# Altium schematic sheet driver_V1.3.SchDoc
size A4
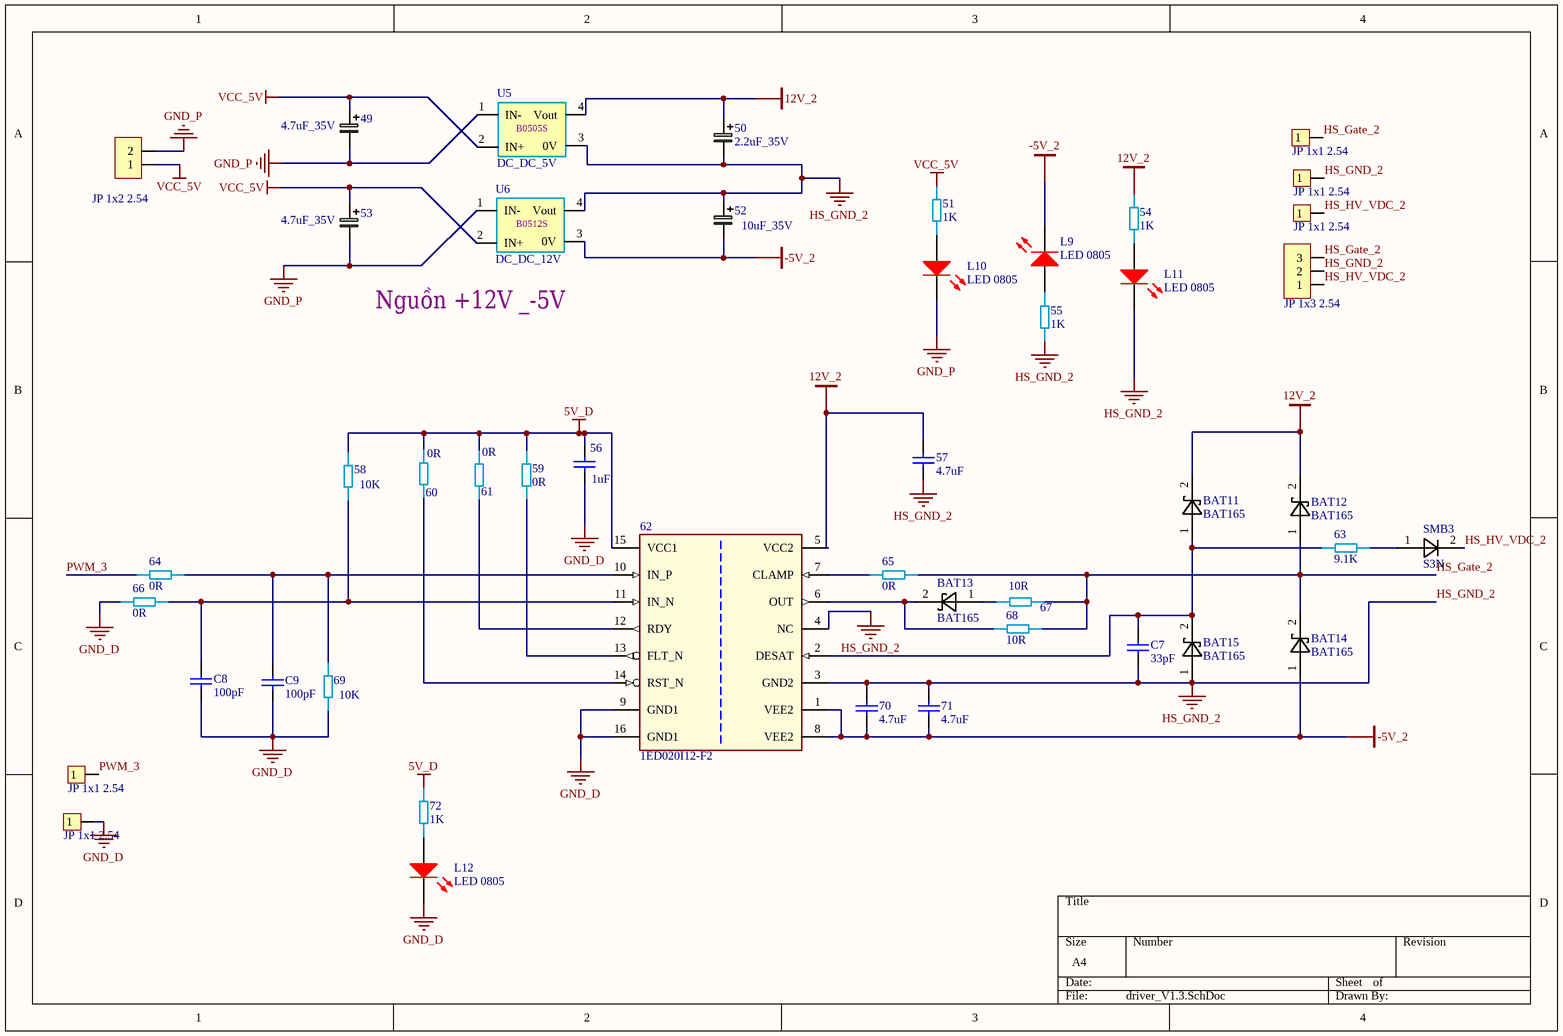
[diagram p0: driver_V1.3.SchDoc]

## Parts
49  4.7uF_35V  [tu_4x5.4mm]
50  2.2uF_35V  [tu_4x5.4mm]
51  1K  [RES1206]
52  10uF_35V  [tu_4x5.4mm]
53  4.7uF_35V  [tu_4x5.4mm]
54  1K  [RES1206]
55  1K  [RES1206]
56  1uF  [Tu 0805_N]
57  4.7uF  [tu 1206_N]
58  10K  [RES1206]
59  0R  [RES1206]
60  0R  [RES1206]
61  0R  [RES1206]
62  1ED020I12-F2  [SOIC127P1028X264-16N-1]
63  9.1K  [RES_2512]
64  0R  [RES1206]
65  0R  [RES_2512]
66  0R  [RES1206]
67  10R  [RES_2512]
68  10R  [RES_2512]
69  10K  [RES1206]
70  4.7uF  [tu 1206_N]
71  4.7uF  [tu 1206_N]
72  1K  [RES1206]
BAT11  BAT165  [SMB]
BAT12  BAT165  [SMB]
BAT13  BAT165  [SMB]
BAT14  BAT165  [SMB]
BAT15  BAT165  [SMB]
C7  33pF  [Tu 0805_N]
C8  100pF  [Tu 0805_N]
C9  100pF  [Tu 0805_N]
JP16  JP 1x1 2.54  [test_point]
JP17  JP 1x2 2.54  [JP 1x2 DT_n]
JP18  JP 1x1 2.54  [test_point]
JP19  JP 1x1 2.54  [test_point]
JP20  JP 1x3 2.54  [XH2.54M-3]
JP21  JP 1x1 2.54  [test_point]
JP22  JP 1x1 2.54  [test_point]
L9  LED 0805  [LED-0805-Red]
L10  LED 0805  [LED-0805-Red]
L11  LED 0805  [LED-0805-Red]
L12  LED 0805  [LED-0805-Red]
SMB3  S3N  [SMB]
U5  DC_DC_5V  [B0505S/D-1W]
U6  DC_DC_12V  [B0512S/D-1W]

## Nets
5V_D: 56.2 58.2 59.1 60.2 61.1 62.15(VCC1) 72.1
12V_2: 50.1 54.1 57.2 62.5(VCC2) BAT11.2 BAT12.2 U5.4(Vout)
-5V_2: 52.2 62.1(VEE2) 62.8(VEE2) 70.1 71.1 BAT14.1 L9.2(K) U6.3(0V)
GND_D: 56.1 62.9(GND1) 62.16(GND1) 66.2 69.1 C8.1 C9.1 JP22.1 L12.2(K)
GND_P: 49.2 53.2 JP17.2 L10.2(K) U5.1(IN-) U6.1(IN-)
HS_GND_2: 50.2 52.1 55.2 57.1 62.3(GND2) 62.4(NC) 70.2 71.2 BAT15.1 C7.1 JP18.1 JP20.2 L11.2(K) U5.3(0V) U6.4(Vout)
VCC_5V: 49.1 51.1 53.1 JP17.1 U5.2(IN+) U6.2(IN+)
HS_Gate_2: 65.2 67.2 68.2 BAT12.1 BAT14.2 JP16.1 JP20.3
HS_HV_VDC_2: JP19.1 JP20.1 SMB3.2
PWM_3: 64.2 JP21.1
Net51_2: 51.2 L10.1(A)
Net54_2: 54.2 L11.1(A)
Net55_1: 55.1 L9.1(A)
Net58_1: 58.1 62.11(IN_N) 66.1 C8.2
Net59_2: 59.2 62.13(FLT_N)
Net60_1: 60.1 62.14(RST_N)
Net61_2: 61.2 62.12(RDY)
Net62_2: 62.2(DESAT) 63.1 BAT11.1 BAT15.2 C7.2
Net62_6: 62.6(OUT) 68.1 BAT13.2
Net62_7: 62.7(CLAMP) 65.1
Net62_10: 62.10(IN_P) 64.1 69.2 C9.2
Net63_2: 63.2 SMB3.1
Net67_1: 67.1 BAT13.1
Net72_2: 72.2 L12.1(A)

## Notes on the sheet
- Nguồn +12V _-5V
- (in symbol DC_DC_5v) B0505S
- (in symbol DC_DC_12v) B0512S

## Library data of the parts
49 50 52 53 = capacitor_electric
51 54 55 58-61 63-69 72 = 311-0.0GRTR-ND
56 C7-C9 = cap_0805
57 70 71 = cap_1210
62 = 1ED020I12-F2: Single IGBT Driver IC; Manufacturer: Infineon Technologies; Manufacturer Order Number: 1ED020I12-F2; PackageReference: PG-DSO-16-15
JP16 JP18 JP19 JP21 JP22 = JP 1x1 2.54 Duc Thang: Cắm; Ten_Linh_Kien: Jump Đơn Đực 2.54MM 1x40P Thẳng 11MM; Don_Vi: Con; Ma_Hang: MH000903; Ghi_Chu: *; Kieu_Chan: *; Chung_Loai: Cắm
JP17 = JP 1x2 2.54 Duc Thang: Cắm; Ten_Linh_Kien: Jump Đơn Đực 2.54MM 1x40P Thẳng 11MM; Don_Vi: Con; Ma_Hang: MH000903; Ghi_Chu: *; Kieu_Chan: *; Chung_Loai: Cắm
JP20 = JP 1x3 2.54 Duc Cong: Cắm; Ten_Linh_Kien: Jump Đơn Đực 2.54MM 1x40P Cong Đứng; Don_Vi: Con; Ma_Hang: MH000904; Ghi_Chu: *; Kieu_Chan: *; Chung_Loai: Cắm
L9-L12 = LED 0805 Do: Dán; Don_Vi: Con; Ma_Hang: MH000897; Ten_Linh_Kien: LED 0805 Màu Đỏ (Red); Ghi_Chu: *; Kieu_Chan: *; Chung_Loai: Dán
SMB3 = S3A-S3N